# EAGLE schematic Works_005 (EAGLE 8.2.1)
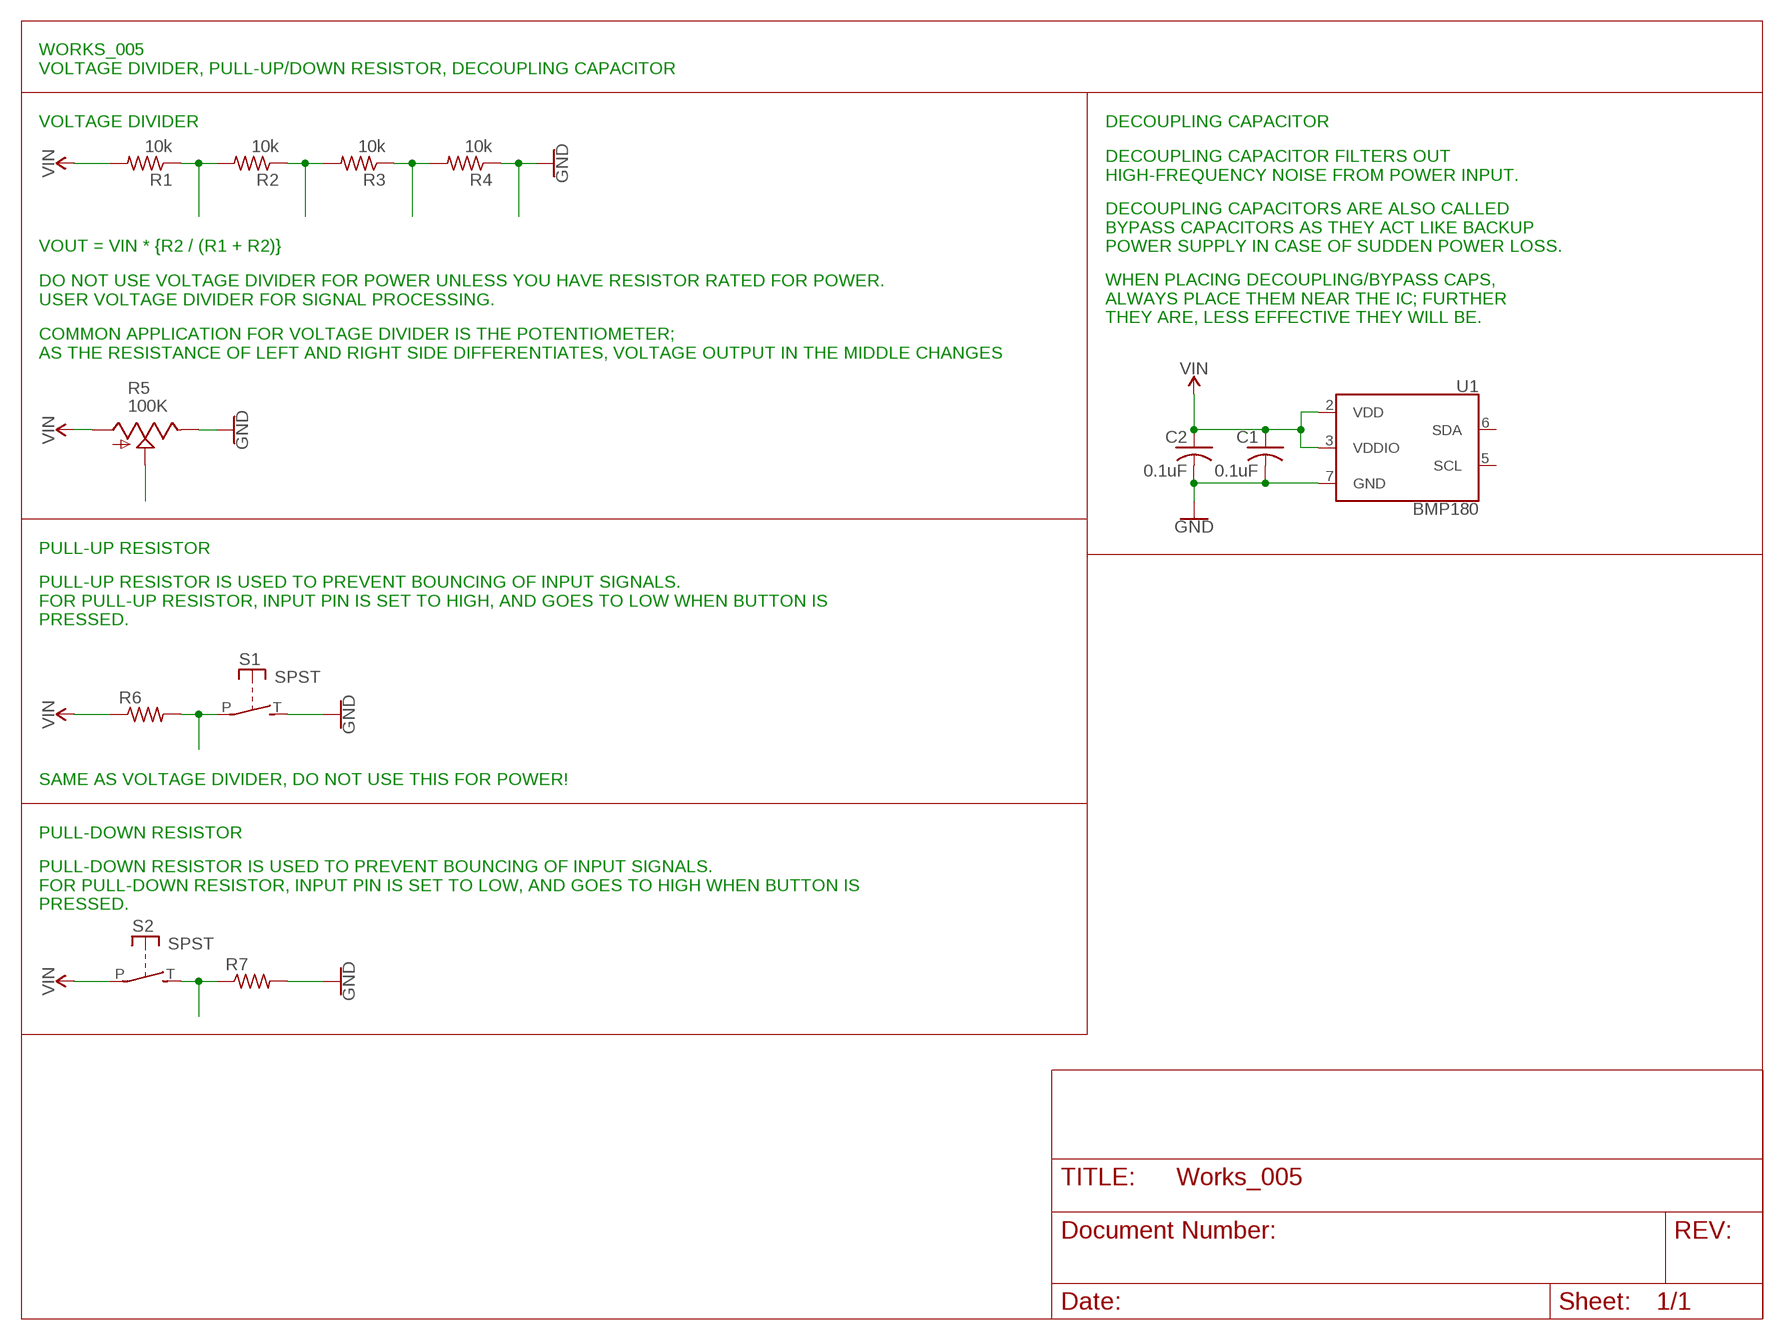
[diagram p0: schematic, sheet 1]

## Parts
C1  0.1uF  C-USC0805  [C0805]
C2  0.1uF  C-USC0805  [C0805]
R1  10k  R-US_R0805  [R0805]
R2  10k  R-US_R0805  [R0805]
R3  10k  R-US_R0805  [R0805]
R4  10k  R-US_R0805  [R0805]
R5  100K  TRIM_US-ST10  [ST10]
R6  R-US_R0805  [R0805]
R7  R-US_R0805  [R0805]
S1  SPST  [JUDCOSPST]
S2  SPST  [JUDCOSPST]
U1  BMP180  [BMP180]

## Nets
GND: C1.2 C2.2 R4.1 R5.E R7.2 S1.T(S) U1.7(GND)
N$1: R1.1 R2.2
N$2: R2.1 R3.2
N$3: R3.1 R4.2
N$4: R5.S
N$5: R6.2 S1.P
N$6: R7.1 S2.T(S)
VIN: C1.1 C2.1 R1.2 R5.A R6.1 S2.P U1.2(VDD) U1.3(VDDIO)
Unconnected: U1.5(SCL) U1.6(SDA)

## Notes on the sheet
- WORKS_005
  VOLTAGE DIVIDER, PULL-UP/DOWN RESISTOR, DECOUPLING CAPACITOR
- VOLTAGE DIVIDER | DECOUPLING CAPACITOR
- DECOUPLING CAPACITOR FILTERS OUT
  HIGH-FREQUENCY NOISE FROM POWER INPUT.
- VOUT = VIN * {R2 / (R1 + R2)}
- DECOUPLING CAPACITORS ARE ALSO CALLED
  BYPASS CAPACITORS AS THEY ACT LIKE BACKUP
  POWER SUPPLY IN CASE OF SUDDEN POWER LOSS.
- DO NOT USE VOLTAGE DIVIDER FOR POWER UNLESS YOU HAVE RESISTOR RATED FOR POWER.
  USER VOLTAGE DIVIDER FOR SIGNAL PROCESSING.
- WHEN PLACING DECOUPLING/BYPASS CAPS,
  ALWAYS PLACE THEM NEAR THE IC; FURTHER
  THEY ARE, LESS EFFECTIVE THEY WILL BE.
- COMMON APPLICATION FOR VOLTAGE DIVIDER IS THE POTENTIOMETER;
  AS THE RESISTANCE OF LEFT AND RIGHT SIDE DIFFERENTIATES, VOLTAGE OUTPUT IN THE MIDDLE CHANGES
- PULL-UP RESISTOR
- PULL-UP RESISTOR IS USED TO PREVENT BOUNCING OF INPUT SIGNALS.
  FOR PULL-UP RESISTOR, INPUT PIN IS SET TO HIGH, AND GOES TO LOW WHEN BUTTON IS
  PRESSED.
- SAME AS VOLTAGE DIVIDER, DO NOT USE THIS FOR POWER!
- PULL-DOWN RESISTOR
- PULL-DOWN RESISTOR IS USED TO PREVENT BOUNCING OF INPUT SIGNALS.
  FOR PULL-DOWN RESISTOR, INPUT PIN IS SET TO LOW, AND GOES TO HIGH WHEN BUTTON IS
  PRESSED.

## Library data of the parts
C1 C2 = adafruit:C-US: CAPACITOR, American symbol
R1-R4 R6 R7 = adafruit:R-US_: RESISTOR, American symbol
R5 = pot:TRIM_US-: POTENTIOMETER
S1 S2 = adafruit:SPST: Judco 50-0015-00
U1 = SparkFun-Sensors:BMP180: Bosch BMP180 Digital Barometric Pressures Sensor The BMP180 is the function compatible successor of the BMP085, a new generation of high precision digital pressure sensors for consumer applications. The ultra-low power, low voltage electronics of the BMP180 is optimized for use in mobile phones, PDAs, GPS navigation devices and outdoor equipment. With a low altitude noise of merely 0.25m at fast conversion time, the BMP180 offers superior performance. The I2C interface allows for easy system integration with a microcontroller. The BMP180 is based on piezo-resistive technology for EMC robustness, high accuracy and linearity as well as long term stability. Web page: http://www.bosch-sensortec.com/en/homepage/products_3/environmental_sensors_1/bmp180_1/bmp180 Datasheet: http://ae-bst.resource.bosch.com/media/products/dokumente/bmp180/BST-BMP180-DS000-09.pdf SparkFun Products Barometric Pressure Sensor - BMP180 <https://www.sparkfun.com/products/11823> (COM-11823) SparkFun Barometric Pressure Sensor Breakout - BMP180 <https://www.sparkfun.com/products/11824> (SEN-11824); PROD_ID: IC-11600; SF_ID: 11823